# Altium schematic sheet Jonathan ESC.SchDoc: Jonathan ESC Full
size A; Revision: 2.0; SheetNumber: 1; SheetTotal: 3
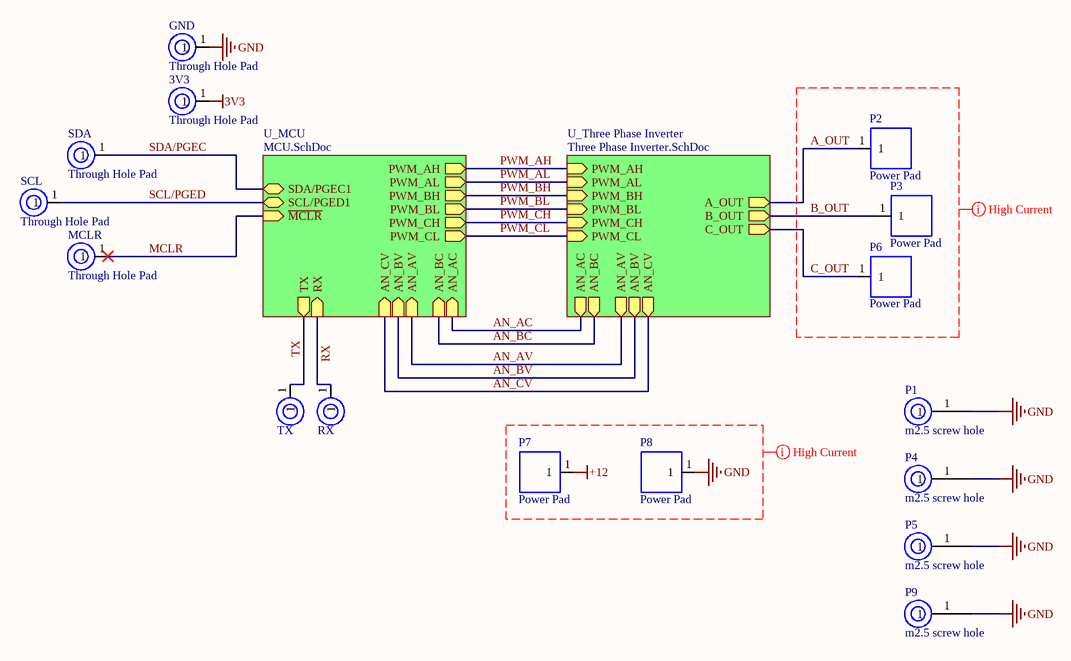
[diagram p0: Jonathan ESC.SchDoc]

## Parts
3V3  Through Hole Pad  [THROUGH HOLE PAD]  (no BOM)
GND  Through Hole Pad  [THROUGH HOLE PAD]  (no BOM)
MCLR  Through Hole Pad  [THROUGH HOLE PAD]  (no BOM)
P1  m2.5 screw hole  [m2.5 screw hole]
P2  Power Pad  [Power Pad]  (no BOM)
P3  Power Pad  [Power Pad]  (no BOM)
P4  m2.5 screw hole  [m2.5 screw hole]
P5  m2.5 screw hole  [m2.5 screw hole]
P6  Power Pad  [Power Pad]  (no BOM)
P7  Power Pad  [Power Pad]  (no BOM)
P8  Power Pad  [Power Pad]  (no BOM)
P9  m2.5 screw hole  [m2.5 screw hole]
RX  RX  [THROUGH HOLE PAD]  (value not drawn)  (no BOM)
SCL  Through Hole Pad  [THROUGH HOLE PAD]  (no BOM)
SDA  Through Hole Pad  [THROUGH HOLE PAD]  (no BOM)
TX  TX  [THROUGH HOLE PAD]  (value not drawn)  (no BOM)

## Sub-sheets
U_MCU = MCU.SchDoc: SCL/PGED1 (bidir), SDA/PGEC1 (bidir), PWM_CL (out), PWM_AH (out), PWM_AL (out), PWM_BH (out), PWM_CH (out), PWM_BL (out), ~{MCLR} (in), AN_BV (in), AN_AV (in), AN_CV (in), AN_BC (in), AN_AC (in), TX (out), RX (in)
U_Three Phase Inverter = Three Phase Inverter.SchDoc: C_OUT (out), AN_AC (out), A_OUT (out), AN_BV (out), AN_BC (out), PWM_AL (in), B_OUT (out), PWM_BL (in), AN_CV (out), PWM_CL (in), PWM_AH (in), PWM_CH (in), AN_AV (out), PWM_BH (in)

## Nets
3V3: 3V3.1
+12: P7.1
GND: GND.1 P1.1 P4.1 P5.1 P8.1 P9.1
A_OUT: P2.1 ; sheet U_Three Phase Inverter/A_OUT
AN_AC: sheet U_MCU/AN_AC, sheet U_Three Phase Inverter/AN_AC
AN_AV: sheet U_MCU/AN_AV, sheet U_Three Phase Inverter/AN_AV
AN_BC: sheet U_MCU/AN_BC, sheet U_Three Phase Inverter/AN_BC
AN_BV: sheet U_MCU/AN_BV, sheet U_Three Phase Inverter/AN_BV
AN_CV: sheet U_MCU/AN_CV, sheet U_Three Phase Inverter/AN_CV
B_OUT: P3.1 ; sheet U_Three Phase Inverter/B_OUT
C_OUT: P6.1 ; sheet U_Three Phase Inverter/C_OUT
MCLR: MCLR.1 ; sheet U_MCU/~{MCLR}
PWM_AH: sheet U_MCU/PWM_AH, sheet U_Three Phase Inverter/PWM_AH
PWM_AL: sheet U_MCU/PWM_AL, sheet U_Three Phase Inverter/PWM_AL
PWM_BH: sheet U_MCU/PWM_BH, sheet U_Three Phase Inverter/PWM_BH
PWM_BL: sheet U_MCU/PWM_BL, sheet U_Three Phase Inverter/PWM_BL
PWM_CH: sheet U_MCU/PWM_CH, sheet U_Three Phase Inverter/PWM_CH
PWM_CL: sheet U_MCU/PWM_CL, sheet U_Three Phase Inverter/PWM_CL
RX: RX.1 ; sheet U_MCU/RX
SCL/PGED: SCL.1 ; sheet U_MCU/SCL/PGED1
SDA/PGEC: SDA.1 ; sheet U_MCU/SDA/PGEC1
TX: TX.1 ; sheet U_MCU/TX

## Layout directives
net class High Current: +12, A_OUT, B_OUT, C_OUT, GND

## Notes on the sheet
- Title
- Size:
- Date:
- A
- Number:
- Time:
- Revision:
- Sheet
- of
- File:

## Library data of the parts
RX TX = Through Hole Pad